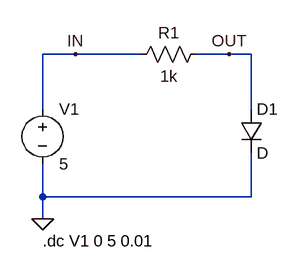
[diagram p0: schematic Assignment 2-2 -  LTspice DC Sweep I-V.asc]
Assignment 2-2 -  LTspice DC Sweep I-V.asc, the LTspice schematic file:
Version 4.1
SHEET 1 880 680
WIRE 64 64 16 64
WIRE 160 64 64 64
WIRE 288 64 240 64
WIRE 320 64 288 64
WIRE 16 144 16 64
WIRE 320 144 320 64
WIRE 16 272 16 224
WIRE 320 272 320 208
WIRE 320 272 16 272
WIRE 16 304 16 272
FLAG 16 304 0
FLAG 64 64 IN
FLAG 288 64 OUT
SYMBOL voltage 16 128 R0
SYMATTR InstName V1
SYMATTR Value 5
SYMBOL res 256 48 R90
WINDOW 0 0 56 VBottom 2
WINDOW 3 32 56 VTop 2
SYMATTR InstName R1
SYMATTR Value 1k
SYMBOL diode 304 144 R0
SYMATTR InstName D1
TEXT 16 336 Left 2 !.dc V1 0 5 0.01

The netlist it stands for:
* Assignment 2-2 -  LTspice DC Sweep I-V.asc
V1 IN 0 5
R1 OUT IN 1k
D1 OUT 0 D
.model D D
.lib standard.dio
.dc V1 0 5 0.01
.backanno
.end